# Altium schematic sheet motordriver-v5.1_top-level.SchDoc
size 420 x 297 mm; SheetNumber: 1; SheetTotal: 13
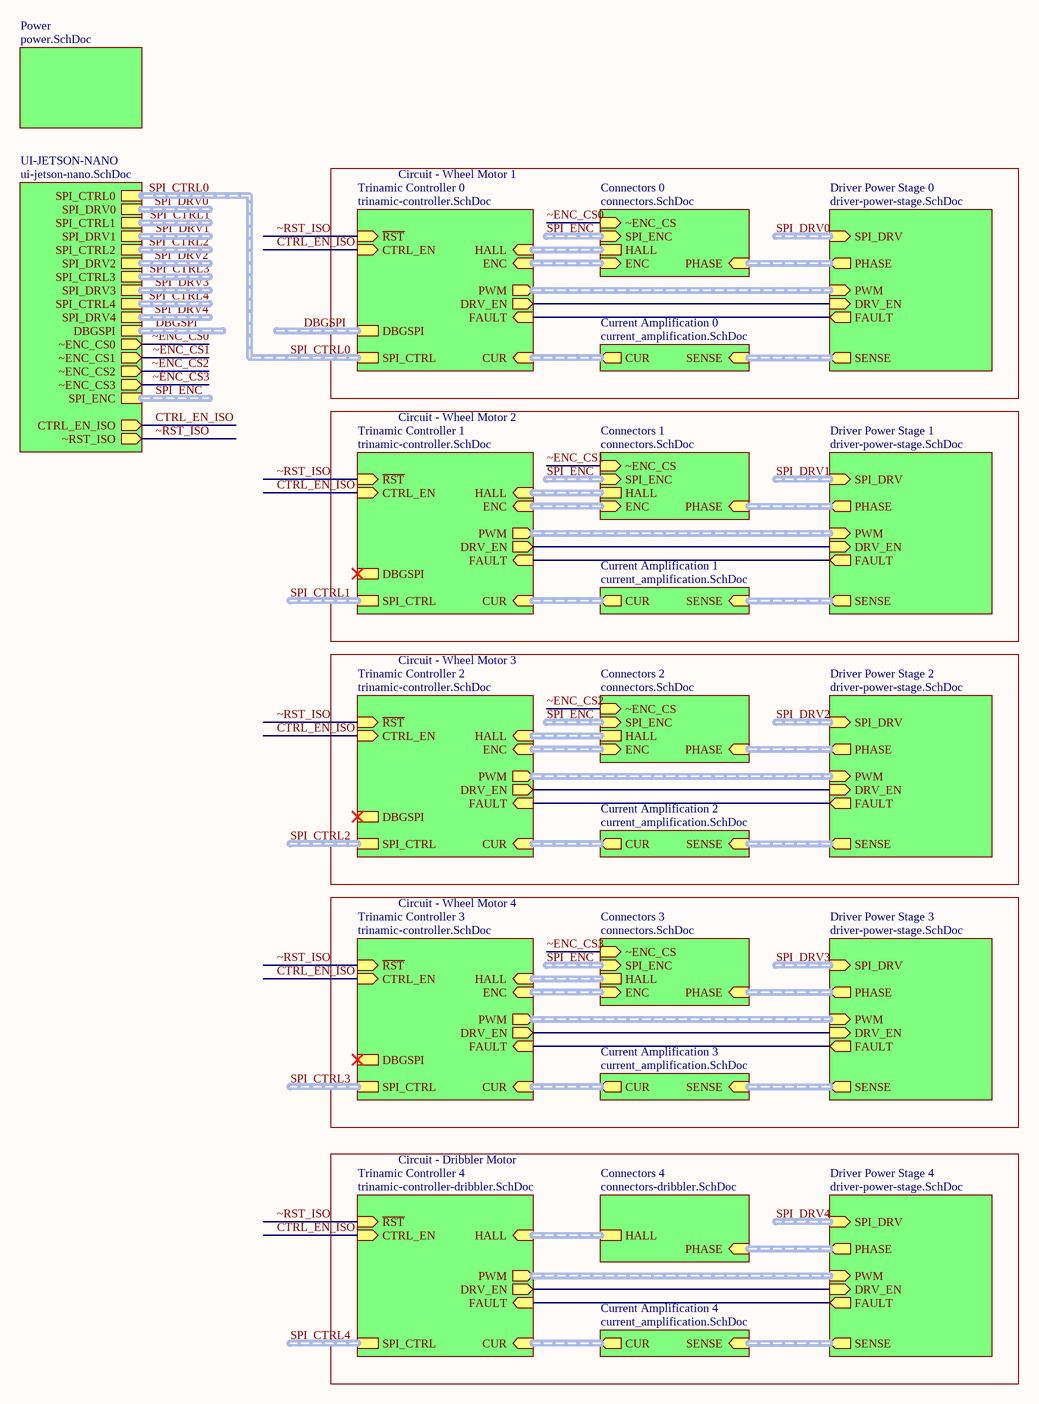
[diagram p0: motordriver-v5.1_top-level.SchDoc]

## Sub-sheets
Connectors 0 = connectors.SchDoc: PHASE (in, harness PHASE), HALL (harness HALL), ENC (in, harness ENC), SPI_ENC (in, harness SPI_ENC), ~ENC_CS (in)
Connectors 1 = connectors.SchDoc: PHASE (in, harness PHASE), HALL (harness HALL), ENC (in, harness ENC), SPI_ENC (in, harness SPI_ENC), ~ENC_CS (in)
Connectors 2 = connectors.SchDoc: PHASE (in, harness PHASE), HALL (harness HALL), ENC (in, harness ENC), SPI_ENC (in, harness SPI_ENC), ~ENC_CS (in)
Connectors 3 = connectors.SchDoc: PHASE (in, harness PHASE), HALL (harness HALL), ENC (in, harness ENC), SPI_ENC (in, harness SPI_ENC), ~ENC_CS (in)
Connectors 4 = connectors-dribbler.SchDoc: PHASE (in, harness PHASE), HALL (harness HALL)
Current Amplification 0 = current_amplification.SchDoc: SENSE (in, harness SENSE), CUR (out, harness CUR)
Current Amplification 1 = current_amplification.SchDoc: SENSE (in, harness SENSE), CUR (out, harness CUR)
Current Amplification 2 = current_amplification.SchDoc: SENSE (in, harness SENSE), CUR (out, harness CUR)
Current Amplification 3 = current_amplification.SchDoc: SENSE (in, harness SENSE), CUR (out, harness CUR)
Current Amplification 4 = current_amplification.SchDoc: SENSE (in, harness SENSE), CUR (out, harness CUR)
Driver Power Stage 0 = driver-power-stage.SchDoc: DRV_EN (in), PWM (in, harness PWM), FAULT (out), SENSE (out, harness SENSE), PHASE (out, harness PHASE), SPI_DRV (in, harness DRV)
Driver Power Stage 1 = driver-power-stage.SchDoc: DRV_EN (in), PWM (in, harness PWM), FAULT (out), SENSE (out, harness SENSE), PHASE (out, harness PHASE), SPI_DRV (in, harness DRV)
Driver Power Stage 2 = driver-power-stage.SchDoc: DRV_EN (in), PWM (in, harness PWM), FAULT (out), SENSE (out, harness SENSE), PHASE (out, harness PHASE), SPI_DRV (in, harness DRV)
Driver Power Stage 3 = driver-power-stage.SchDoc: DRV_EN (in), PWM (in, harness PWM), FAULT (out), SENSE (out, harness SENSE), PHASE (out, harness PHASE), SPI_DRV (in, harness DRV)
Driver Power Stage 4 = driver-power-stage.SchDoc: DRV_EN (in), PWM (in, harness PWM), FAULT (out), SENSE (out, harness SENSE), PHASE (out, harness PHASE), SPI_DRV (in, harness DRV)
Power = power.SchDoc: no entries
Trinamic Controller 0 = trinamic-controller.SchDoc: ~{RST} (in), CUR (in, harness CUR), DRV_EN (out), CTRL_EN (in), PWM (out, harness PWM), HALL (in, harness HALL), FAULT (in), ENC (in, harness ENC), SPI_CTRL (harness CTRL), DBGSPI (harness DRV)
Trinamic Controller 1 = trinamic-controller.SchDoc: ~{RST} (in), CUR (in, harness CUR), DRV_EN (out), CTRL_EN (in), PWM (out, harness PWM), HALL (in, harness HALL), FAULT (in), ENC (in, harness ENC), SPI_CTRL (harness CTRL), DBGSPI (harness DRV)
Trinamic Controller 2 = trinamic-controller.SchDoc: ~{RST} (in), CUR (in, harness CUR), DRV_EN (out), CTRL_EN (in), PWM (out, harness PWM), HALL (in, harness HALL), FAULT (in), ENC (in, harness ENC), SPI_CTRL (harness CTRL), DBGSPI (harness DRV)
Trinamic Controller 3 = trinamic-controller.SchDoc: ~{RST} (in), CUR (in, harness CUR), DRV_EN (out), CTRL_EN (in), PWM (out, harness PWM), HALL (in, harness HALL), FAULT (in), ENC (in, harness ENC), SPI_CTRL (harness CTRL), DBGSPI (harness DRV)
Trinamic Controller 4 = trinamic-controller-dribbler.SchDoc: ~{RST} (in), CUR (in, harness CUR), DRV_EN (out), CTRL_EN (in), PWM (out, harness PWM), HALL (in, harness HALL), FAULT (in), SPI_CTRL (harness CTRL)
UI-JETSON-NANO = ui-jetson-nano.SchDoc: SPI_CTRL0 (harness CTRL), SPI_DRV0 (harness DRV), SPI_ENC (harness SPI_ENC), ~ENC_CS0 (out), ~ENC_CS1 (out), ~ENC_CS2 (out), ~ENC_CS3 (out), SPI_CTRL4 (harness CTRL), SPI_CTRL1 (harness CTRL), SPI_DRV1 (harness DRV), SPI_CTRL2 (harness CTRL), SPI_DRV2 (harness DRV), SPI_CTRL3 (harness CTRL), SPI_DRV3 (harness DRV), SPI_DRV4 (harness DRV), ~RST_ISO (out), CTRL_EN_ISO (out), DBGSPI (harness DRV)

## Nets
CTRL_EN_ISO: sheet Trinamic Controller 0/CTRL_EN, sheet UI-JETSON-NANO/CTRL_EN_ISO, sheet Trinamic Controller 4/CTRL_EN, sheet Trinamic Controller 1/CTRL_EN, sheet Trinamic Controller 2/CTRL_EN, sheet Trinamic Controller 3/CTRL_EN
~ENC_CS0: sheet Connectors 0/~ENC_CS, sheet UI-JETSON-NANO/~ENC_CS0
~ENC_CS1: sheet UI-JETSON-NANO/~ENC_CS1, sheet Connectors 1/~ENC_CS
~ENC_CS2: sheet UI-JETSON-NANO/~ENC_CS2, sheet Connectors 2/~ENC_CS
~ENC_CS3: sheet UI-JETSON-NANO/~ENC_CS3, sheet Connectors 3/~ENC_CS
~RST_ISO: sheet Trinamic Controller 0/~{RST}, sheet UI-JETSON-NANO/~RST_ISO, sheet Trinamic Controller 4/~{RST}, sheet Trinamic Controller 1/~{RST}, sheet Trinamic Controller 2/~{RST}, sheet Trinamic Controller 3/~{RST}
(unnamed): sheet Driver Power Stage 0/DRV_EN, sheet Trinamic Controller 0/DRV_EN
(unnamed): sheet Driver Power Stage 0/FAULT, sheet Trinamic Controller 0/FAULT
(unnamed): sheet Driver Power Stage 4/DRV_EN, sheet Trinamic Controller 4/DRV_EN
(unnamed): sheet Driver Power Stage 4/FAULT, sheet Trinamic Controller 4/FAULT
(unnamed): sheet Driver Power Stage 1/DRV_EN, sheet Trinamic Controller 1/DRV_EN
(unnamed): sheet Driver Power Stage 1/FAULT, sheet Trinamic Controller 1/FAULT
(unnamed): sheet Driver Power Stage 2/DRV_EN, sheet Trinamic Controller 2/DRV_EN
(unnamed): sheet Driver Power Stage 2/FAULT, sheet Trinamic Controller 2/FAULT
(unnamed): sheet Driver Power Stage 3/DRV_EN, sheet Trinamic Controller 3/DRV_EN
(unnamed): sheet Driver Power Stage 3/FAULT, sheet Trinamic Controller 3/FAULT

## Buses and harness runs
harness DBGSPI = sheet Trinamic Controller 0/DBGSPI
harness DBGSPI = sheet UI-JETSON-NANO/DBGSPI
harness sheet Connectors 0/ENC = sheet Trinamic Controller 0/ENC
harness sheet Connectors 0/HALL = sheet Trinamic Controller 0/HALL
harness sheet Connectors 0/PHASE = sheet Driver Power Stage 0/PHASE
harness sheet Connectors 1/ENC = sheet Trinamic Controller 1/ENC
harness sheet Connectors 1/HALL = sheet Trinamic Controller 1/HALL
harness sheet Connectors 1/PHASE = sheet Driver Power Stage 1/PHASE
harness sheet Connectors 2/ENC = sheet Trinamic Controller 2/ENC
harness sheet Connectors 2/HALL = sheet Trinamic Controller 2/HALL
harness sheet Connectors 2/PHASE = sheet Driver Power Stage 2/PHASE
harness sheet Connectors 3/ENC = sheet Trinamic Controller 3/ENC
harness sheet Connectors 3/HALL = sheet Trinamic Controller 3/HALL
harness sheet Connectors 3/PHASE = sheet Driver Power Stage 3/PHASE
harness sheet Connectors 4/HALL = sheet Trinamic Controller 4/HALL
harness sheet Connectors 4/PHASE = sheet Driver Power Stage 4/PHASE
harness sheet Current Amplification 0/CUR = sheet Trinamic Controller 0/CUR
harness sheet Current Amplification 0/SENSE = sheet Driver Power Stage 0/SENSE
harness sheet Current Amplification 1/CUR = sheet Trinamic Controller 1/CUR
harness sheet Current Amplification 1/SENSE = sheet Driver Power Stage 1/SENSE
harness sheet Current Amplification 2/CUR = sheet Trinamic Controller 2/CUR
harness sheet Current Amplification 2/SENSE = sheet Driver Power Stage 2/SENSE
harness sheet Current Amplification 3/CUR = sheet Trinamic Controller 3/CUR
harness sheet Current Amplification 3/SENSE = sheet Driver Power Stage 3/SENSE
harness sheet Current Amplification 4/CUR = sheet Trinamic Controller 4/CUR
harness sheet Current Amplification 4/SENSE = sheet Driver Power Stage 4/SENSE
harness sheet Driver Power Stage 0/PWM = sheet Trinamic Controller 0/PWM
harness sheet Driver Power Stage 1/PWM = sheet Trinamic Controller 1/PWM
harness sheet Driver Power Stage 2/PWM = sheet Trinamic Controller 2/PWM
harness sheet Driver Power Stage 3/PWM = sheet Trinamic Controller 3/PWM
harness sheet Driver Power Stage 4/PWM = sheet Trinamic Controller 4/PWM
harness SPI_CTRL0 = sheet Trinamic Controller 0/SPI_CTRL = sheet UI-JETSON-NANO/SPI_CTRL0
harness SPI_CTRL1 = sheet Trinamic Controller 1/SPI_CTRL
harness SPI_CTRL1 = sheet UI-JETSON-NANO/SPI_CTRL1
harness SPI_CTRL2 = sheet Trinamic Controller 2/SPI_CTRL
harness SPI_CTRL2 = sheet UI-JETSON-NANO/SPI_CTRL2
harness SPI_CTRL3 = sheet Trinamic Controller 3/SPI_CTRL
harness SPI_CTRL3 = sheet UI-JETSON-NANO/SPI_CTRL3
harness SPI_CTRL4 = sheet Trinamic Controller 4/SPI_CTRL
harness SPI_CTRL4 = sheet UI-JETSON-NANO/SPI_CTRL4
harness SPI_DRV0 = sheet Driver Power Stage 0/SPI_DRV
harness SPI_DRV0 = sheet UI-JETSON-NANO/SPI_DRV0
harness SPI_DRV1 = sheet Driver Power Stage 1/SPI_DRV
harness SPI_DRV1 = sheet UI-JETSON-NANO/SPI_DRV1
harness SPI_DRV2 = sheet Driver Power Stage 2/SPI_DRV
harness SPI_DRV2 = sheet UI-JETSON-NANO/SPI_DRV2
harness SPI_DRV3 = sheet Driver Power Stage 3/SPI_DRV
harness SPI_DRV3 = sheet UI-JETSON-NANO/SPI_DRV3
harness SPI_DRV4 = sheet Driver Power Stage 4/SPI_DRV
harness SPI_DRV4 = sheet UI-JETSON-NANO/SPI_DRV4
harness SPI_ENC = sheet Connectors 0/SPI_ENC
harness SPI_ENC = sheet Connectors 1/SPI_ENC
harness SPI_ENC = sheet Connectors 2/SPI_ENC
harness SPI_ENC = sheet Connectors 3/SPI_ENC
harness SPI_ENC = sheet UI-JETSON-NANO/SPI_ENC

## Notes on the sheet
- Circuit - Wheel Motor 1
- Circuit - Wheel Motor 2
- Circuit - Wheel Motor 3
- Circuit - Wheel Motor 4
- Circuit - Dribbler Motor
- TITLE
- SCALE:
- A3
- SIZE
- FILE NAME
- SHEET
- OF
- REV